# EAGLE design EddieBoardA (EAGLE 7.0.0)
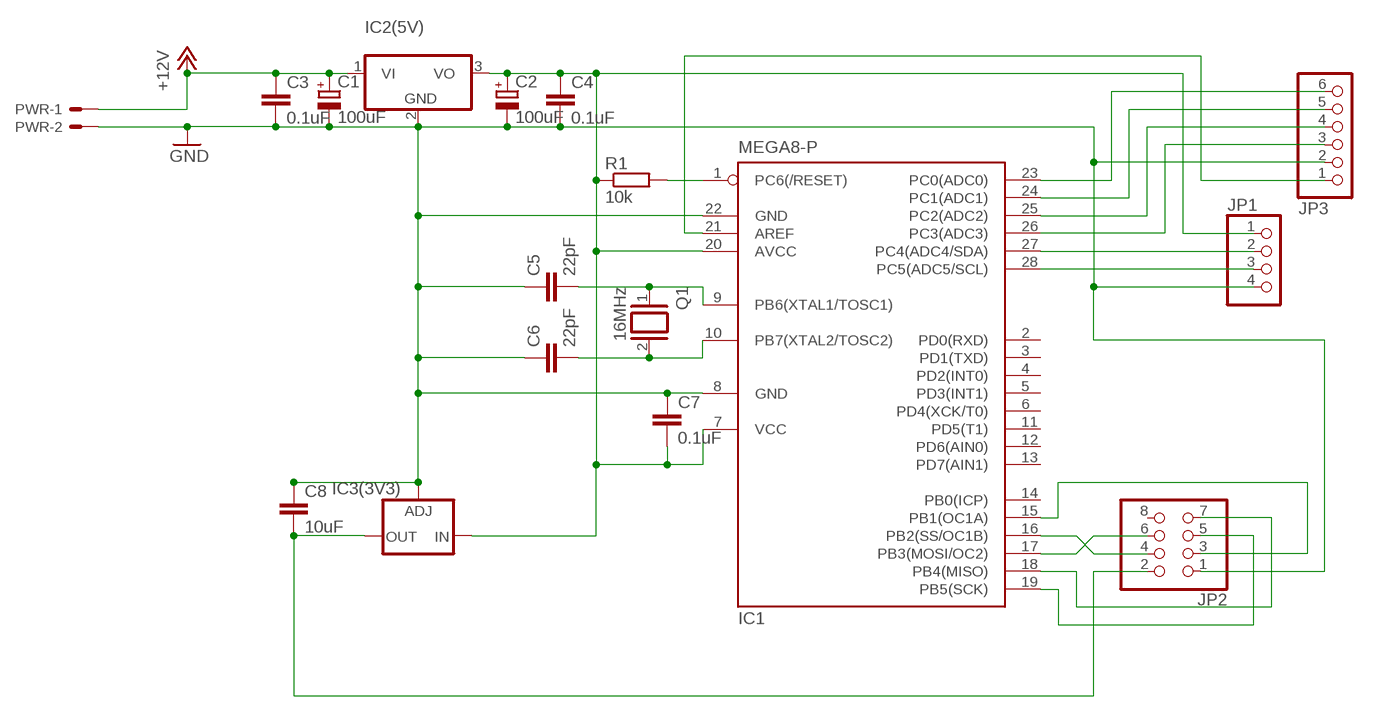
[diagram p0: schematic, sheet 1]

## Parts
C1  100uF  CPOL-EUE2.5-6  [E2,5-6]
C2  100uF  CPOL-EUE2.5-6  [E2,5-6]
C3  0.1uF  C-EU025-025X050  [C025-025X050]
C4  0.1uF  C-EU025-025X050  [C025-025X050]
C5  22pF  C-EU025-025X050  [C025-025X050]
C6  22pF  C-EU025-025X050  [C025-025X050]
C7  0.1uF  C-EU025-025X050  [C025-025X050]
C8  10uF  C-EU025-025X050  [C025-025X050]
IC1  MEGA8-P  [DIL28-3]
IC2(5V)  7805TV  [TO220V]
IC3(3V3)  LD117AV  [TO220L1]
JP1  PINHD-1X4  [1X04]
JP2  PINHD-2X4  [2X04]
JP3  PINHD-1X6  [1X06]
PWR  22-23-2021  [22-23-2021]
Q1  16MHz  XTAL/S  [QS]
R1  10k  R-EU_0207/12  [0207/12]

## Nets
+12V: C1.+ C3.1 IC2(5V).1(VI) PWR.1
GND: C1.- C2.- C3.2 C4.2 C5.1 C6.1 C7.1 C8.1 IC1.8(GND) IC1.22(GND) IC2(5V).2(GND) IC3(3V3).1(ADJ) JP1.4 JP2.1 JP3.2 PWR.2
N$1: IC1.1(PC6(/RESET)) R1.2
N$2: IC1.27(PC4(ADC4/SDA)) JP1.2
N$4: C5.2 IC1.9(PB6(XTAL1/TOSC1)) Q1.1
N$5: C6.2 IC1.10(PB7(XTAL2/TOSC2)) Q1.2
N$6: IC1.28(PC5(ADC5/SCL)) JP1.3
N$7: IC1.19(PB5(SCK)) JP2.5
N$8: IC1.15(PB1(OC1A)) JP2.3
N$9: IC1.17(PB3(MOSI/OC2)) JP2.6
N$10: IC1.16(PB2(SS/OC1B)) JP2.4
N$11: IC1.18(PB4(MISO)) JP2.7
N$12: IC1.21(AREF) JP3.1
N$13: IC1.26(PC3(ADC3)) JP3.3
N$14: IC1.25(PC2(ADC2)) JP3.4
N$15: IC1.24(PC1(ADC1)) JP3.5
N$16: IC1.23(PC0(ADC0)) JP3.6
N$17: C8.2 IC3(3V3).2(OUT) JP2.2
VCC: C2.+ C4.1 C7.2 IC1.7(VCC) IC1.20(AVCC) IC2(5V).3(VO) IC3(3V3).3(IN) JP1.1 R1.1
Unconnected: IC1.2(PD0(RXD)) IC1.3(PD1(TXD)) IC1.4(PD2(INT0)) IC1.5(PD3(INT1)) IC1.6(PD4(XCK/T0)) IC1.11(PD5(T1)) IC1.12(PD6(AIN0)) IC1.13(PD7(AIN1)) IC1.14(PB0(ICP)) JP2.8

## Library data of the parts
C1 C2 = rcl:CPOL-EU: POLARIZED CAPACITOR, European symbol
C3-C8 = rcl:C-EU: CAPACITOR, European symbol
IC1 = atmel:MEGA8-P: MICROCONTROLLER 8 Kbytes FLASH, 1 kbytes SRAM, 512 bytes EEPROM, USART, 4-channel 10 bit ADC, 2-channel 8 bit ADC Pin compatible with Atmega48, ATMega88, ATMega168 Source: avr.lbr; OC_FARNELL: unknown; OC_NEWARK: unknown
IC2(5V) = linear:78*: Positive VOLTAGE REGULATOR Source: http://cache.national.com/ds/LM/LM78L05.pdf http://www.fairchildsemi.com/ds/LM/LM7805.pdf
IC3(3V3) = v-reg_2:LD117A?*: Low drop fixed and adjustable positive voltage regulators 1 A Source: http://www.st.com/stonline/products/literature/ds/7194/ld1117axx.pdf
JP1 = pinhead:PINHD-1X4: PIN HEADER
JP2 = pinhead:PINHD-2X4: PIN HEADER
JP3 = pinhead:PINHD-1X6: PIN HEADER
PWR = con-molex:22-23-2021: .100" (2.54mm) Center Header - 2 Pin; MF: MOLEX; MPN: PWR; OC_FARNELL: 1462926; OC_NEWARK: 25C3832
Q1 = special:XTAL/S: CRYSTAL
R1 = resistor:R-EU_: RESISTOR, European symbol

## Board
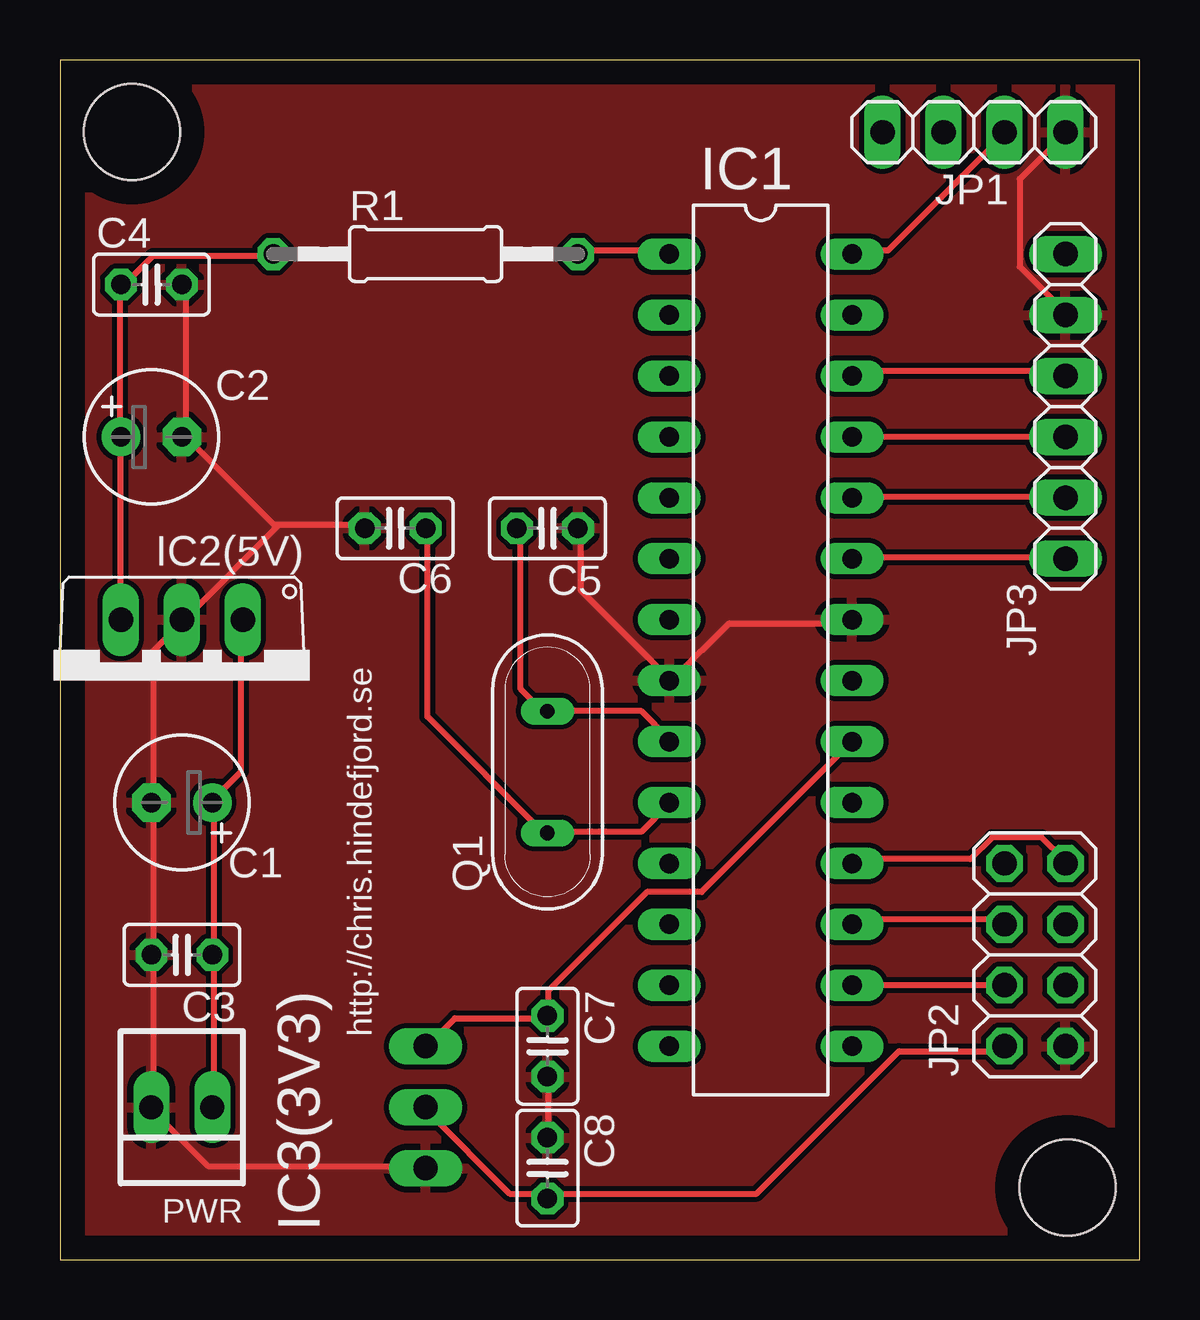
[diagram p1: board, top side]
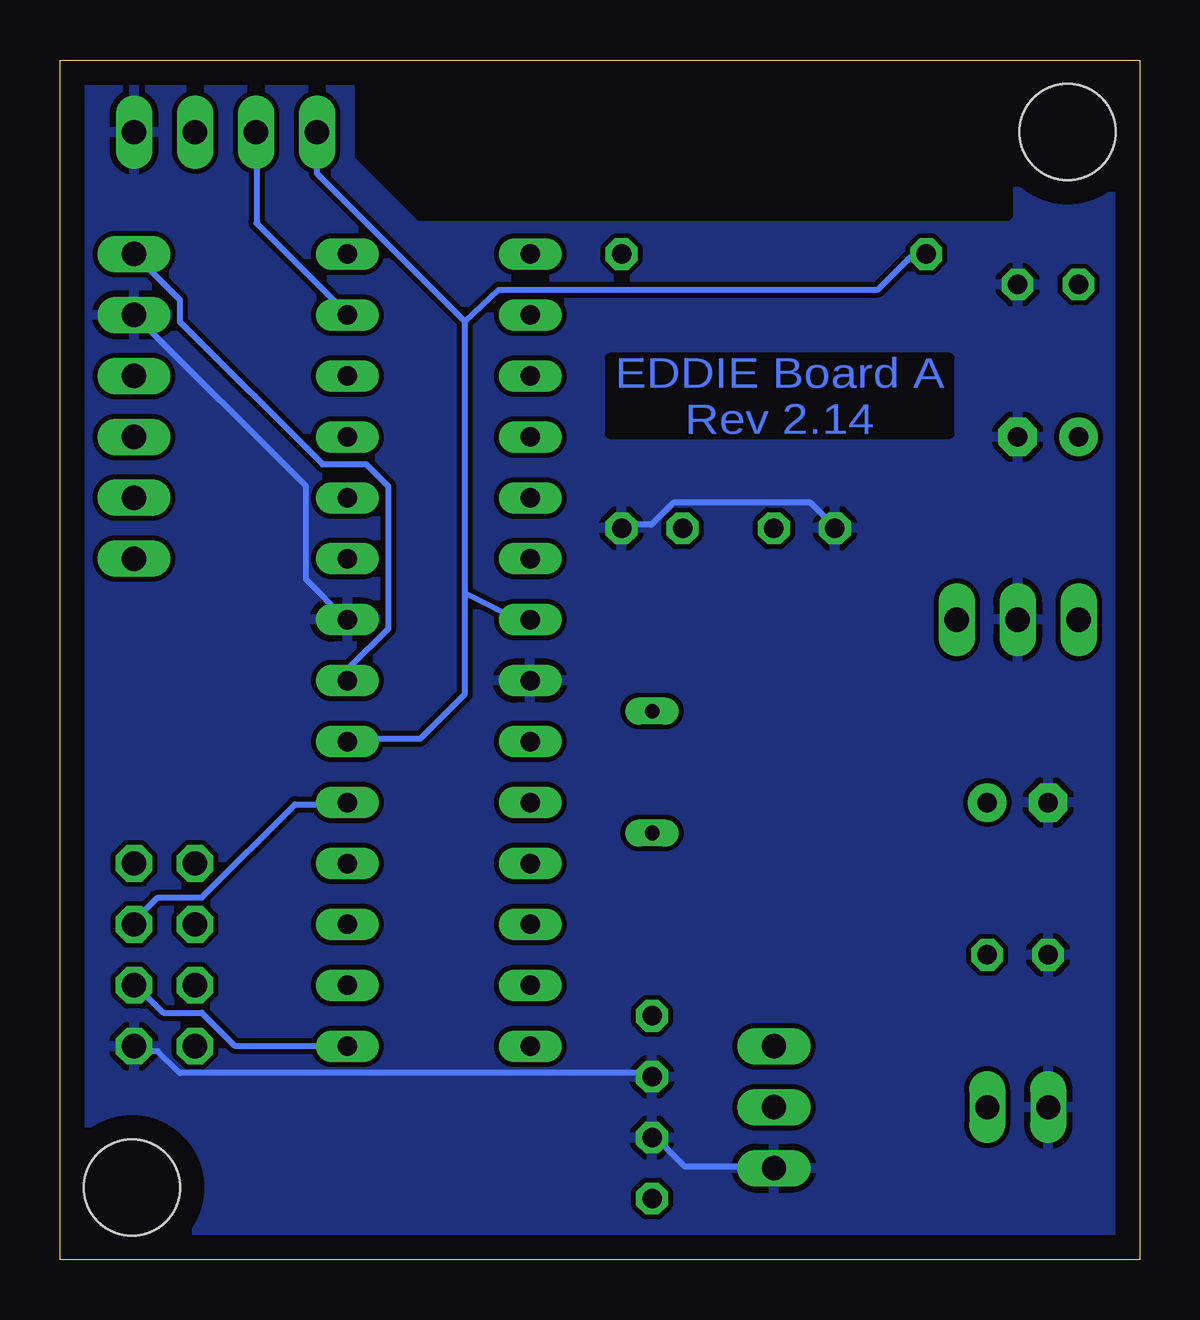
[diagram p2: board, bottom side, seen from below]

Size 45 x 50 mm. Coordinates in mm from the lower left corner, seen from the top.
Outline: 0,0 45,0 45,50 0,50 0,0
Copper layers (1*16): Top 0.035mm / dielectric 1.5mm / Bottom 0.035mm
Design rules "default": minimum track width 10mil, minimum drill 24mil, track to track 8mil, track to pad 8mil, pad to pad 8mil, via to via 8mil, smd to smd 8mil, copper to edge 40mil, drill to drill 8mil, minimum pad ring 10mil, minimum via ring 8mil, stop-mask expansion 4mil, vias tented up to drill 0mil, thermal gap 10mil
Holes 4 mm at 3,47 42,3

### Footprints (pad centres in the part's own frame; a part is rotated, then mirrored left to right if it is on the bottom)
E2,5-6 = drill 0.813 pad 1.6: + -1.27,0 | drill 0.813 pad 1.6 octagon: - 1.27,0
C025-025X050 = drill 0.813 octagon: 1 -1.27,0; 2 1.27,0
DIL28-3 = drill 0.813 long: 1 -16.51,-3.81; 2 -13.97,-3.81; 3 -11.43,-3.81; 4 -8.89,-3.81; 5 -6.35,-3.81; 6 -3.81,-3.81; 7 -1.27,-3.81; 8 1.27,-3.81; 9 3.81,-3.81; 10 6.35,-3.81; 11 8.89,-3.81; 12 11.43,-3.81; 13 13.97,-3.81; 14 16.51,-3.81; 15 16.51,3.81; 16 13.97,3.81; 17 11.43,3.81; 18 8.89,3.81; 19 6.35,3.81; 20 3.81,3.81; 21 1.27,3.81; 22 -1.27,3.81; 23 -3.81,3.81; 24 -6.35,3.81; 25 -8.89,3.81; 26 -11.43,3.81; 27 -13.97,3.81; 28 -16.51,3.81
TO220V = drill 1.016 long: 1 -2.54,-2.54; 2 0,-2.54; 3 2.54,-2.54
TO220L1 = drill 1.016 long: 1 -2.54,-3.81; 2 0,-3.81; 3 2.54,-3.81
1X04 = drill 1.016 long: 1 -3.81,0; 2 -1.27,0; 3 1.27,0; 4 3.81,0
2X04 = drill 1.016 octagon: 1 -3.81,-1.27; 2 -3.81,1.27; 3 -1.27,-1.27; 4 -1.27,1.27; 5 1.27,-1.27; 6 1.27,1.27; 7 3.81,-1.27; 8 3.81,1.27
1X06 = drill 1.016 long: 1 -6.35,0; 2 -3.81,0; 3 -1.27,0; 4 1.27,0; 5 3.81,0; 6 6.35,0
22-23-2021 = drill 1 long: 1 -1.27,0; 2 1.27,0
QS = drill 0.61 long: 1 -2.54,0; 2 2.54,0
0207/12 = drill 0.813 octagon: 1 -6.35,0; 2 6.35,0

### Placement (x,y rotation side)
C1  5.08,19.05 180 top
C2  3.81,34.29 0 top
C3  5.08,12.7 180 top
C4  3.81,40.64 0 top
C5  20.32,30.48 180 top
C6  13.97,30.48 0 top
C7  20.32,8.89 90 top
C8  20.32,3.81 270 top
IC1  29.21,25.4 270 top
IC2(5V)  5.08,24.13 180 top
IC3(3V3)  11.43,6.35 90 top
JP1  38.1,46.99 0 top
JP2  40.64,12.7 90 top
JP3  41.91,35.56 270 top
PWR  5.08,6.35 180 top
Q1  20.32,20.32 270 top
R1  15.24,41.91 0 top

### Tracks (layer width: path | path; a pad name or v marks a point on that pad's centre or on a via)
+12V
  Top 0.254: PWR.1 6.4,6.4 6.4,12.57 C3.1 6.4,12.8 6.4,18.97 C1.+ 6.4,19.2 7.54,20.34 7.54,26.52 IC2(5V).1
GND
  Top 0.254: JP3.2 41.83,39.55 40.01,41.38 40.01,45.03 41.83,46.86 JP1.4 | C5.1 21.72,30.4 21.72,27.89 25.38,24.23 IC1.8 25.6,24.23 27.89,26.52 32.92,26.52 IC1.22 | C8.1 20.34,5.26 20.34,7.54 C7.1 | 9.14,30.63 8.91,30.63 5.26,34.29 | 9.14,30.63 12.57,30.63 C6.1 | 5.26,34.29 5.26,40.46 C4.2 | 5.26,34.29 C2.- | 9.14,30.63 5.26,26.75 IC2(5V).2 5.03,26.52 3.89,25.38 3.89,19.2 C1.- 3.89,18.97 3.89,12.8 C3.2 3.89,12.57 3.89,6.4 PWR.2 3.89,6.17 6.17,3.89 15.09,3.89 IC3(3V3).1
  Bottom 0.254: JP3.2 41.83,39.32 34.75,32.23 34.75,28.35 33.15,26.75 IC1.22 | IC3(3V3).1 15.32,3.89 18.97,3.89 20.12,5.03 C8.1 | JP2.1 41.83,8.69 40.92,8.69 40.01,7.77 20.34,7.77 C7.1 | C5.1 21.49,30.63 20.34,30.63 19.43,31.55 13.72,31.55 12.8,30.63 C6.1
  pour Top: 0,50 45,50 45,0 0,0
  pour Bottom: 0,50 45,50 45,0 0,0
N$1
  Top 0.254: R1.2 21.72,42.06 25.38,42.06 IC1.1
N$2
  Bottom 0.254: IC1.27 33.15,39.55 36.8,43.2 36.8,46.86 JP1.2
N$4
  Top 0.254: IC1.9 25.38,21.72 24.23,22.86 Q1.1 20.12,22.86 19.2,23.77 19.2,30.4 C5.2
N$5
  Top 0.254: IC1.10 25.38,18.97 24.23,17.83 20.34,17.83 Q1.2 20.12,17.83 15.32,22.63 15.32,30.4 C6.2
N$6
  Top 0.254: IC1.28 33.15,42.06 34.52,42.06 39.32,46.86 JP1.3
N$7
  Bottom 0.254: IC1.19 33.15,18.97 35.2,18.97 39.09,15.09 40.92,15.09 41.83,14.17 JP2.5
N$8
  Bottom 0.254: IC1.15 33.15,8.91 37.72,8.91 39.09,10.29 40.69,10.29 41.83,11.43 JP2.3
N$9
  Top 0.254: IC1.17 33.15,14.17 39.32,14.17 JP2.6
N$10
  Top 0.254: JP2.4 IC1.16
N$11
  Top 0.254: IC1.18 33.15,16.69 37.95,16.69 38.86,17.6 40.92,17.6 41.83,16.69 JP2.7
N$12
  Bottom 0.254: JP3.1 40.01,40.01 40.01,39.09 34.06,33.15 32.23,33.15 31.32,32.23 31.32,26.29 32.92,24.69 32.92,24.23 IC1.21
N$13
  Top 0.254: IC1.26 33.15,37.03 41.83,37.03 JP3.3
N$14
  Top 0.254: JP3.4 IC1.25
N$15
  Top 0.254: IC1.24 33.15,31.77 41.83,31.77 JP3.5
N$16
  Top 0.254: IC1.23 33.15,29.26 41.83,29.26 JP3.6
N$17
  Top 0.254: IC3(3V3).2 15.32,6.17 18.75,2.74 20.12,2.74 C8.2 20.34,2.74 29.03,2.74 34.98,8.69 39.32,8.69 JP2.2
N$18
  cutout Bottom: 5.5,49 5.5,43.5 30,43.5 32.5,46 32.5,49
VCC
  Top 0.254: 2.52,34.29 2.52,40.46 C4.1 2.74,40.69 3.89,41.83 8.69,41.83 R1.1 | 2.52,34.29 2.52,26.75 IC2(5V).3 | 2.52,34.29 C2.+ | IC3(3V3).3 15.32,8.91 16.46,10.06 20.12,10.06 C7.2 20.34,10.29 20.34,11.2 24.46,15.32 26.75,15.32 IC1.20
  Bottom 0.254: 28.12,27.79 25.6,26.52 IC1.7 | 28.12,27.79 28.12,23.57 29.97,21.72 32.92,21.72 IC1.20 | JP1.1 34.29,45.26 28.12,39.09 | 28.12,27.79 28.12,39.09 | 28.12,39.09 26.7,40.42 10.9,40.43 9.53,41.8 8.91,41.83 R1.1

### Text on the board
Bottom: EDDIE Board A / Rev 2.14
tNames: http://chris.hindefjord.se
200bmp: D:/Bilder/ChristopherHindefjord_2.bmp